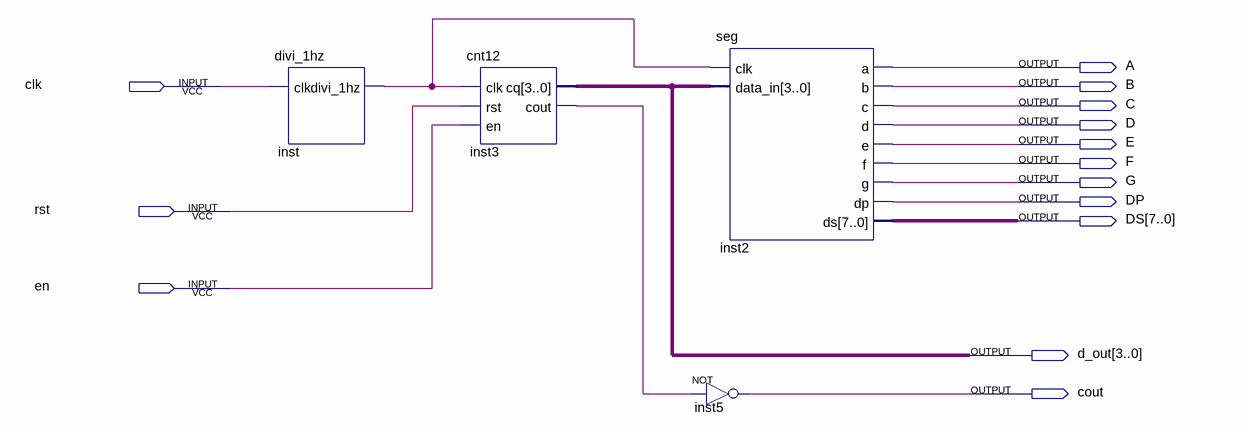
[diagram p0: schematic sheet]
// Quartus schematic cnt12b.bdf as structural Verilog: 4 symbols, 14 pins
module cnt12b (
  input  clk,
  input  rst,
  input  en,
  output A,
  output B,
  output C,
  output D,
  output E,
  output F,
  output G,
  output DP,
  output [7:0] DS,
  output [3:0] d_out,
  output cout
);

  wire inst3_cout, inst_divi_1hz;

  divi_1hz inst (.clk(clk), .divi_1hz(inst_divi_1hz));
  cnt12 inst3 (.clk(inst_divi_1hz), .rst(rst), .en(en), .cq(d_out), .cout(inst3_cout));
  not inst5 (cout, inst3_cout);
  seg inst2 (.clk(inst_divi_1hz), .data_in(d_out), .a(A), .b(B), .c(C), .d(D), .e(E), .f(F), .g(G), .dp(DP), .ds(DS));
endmodule
